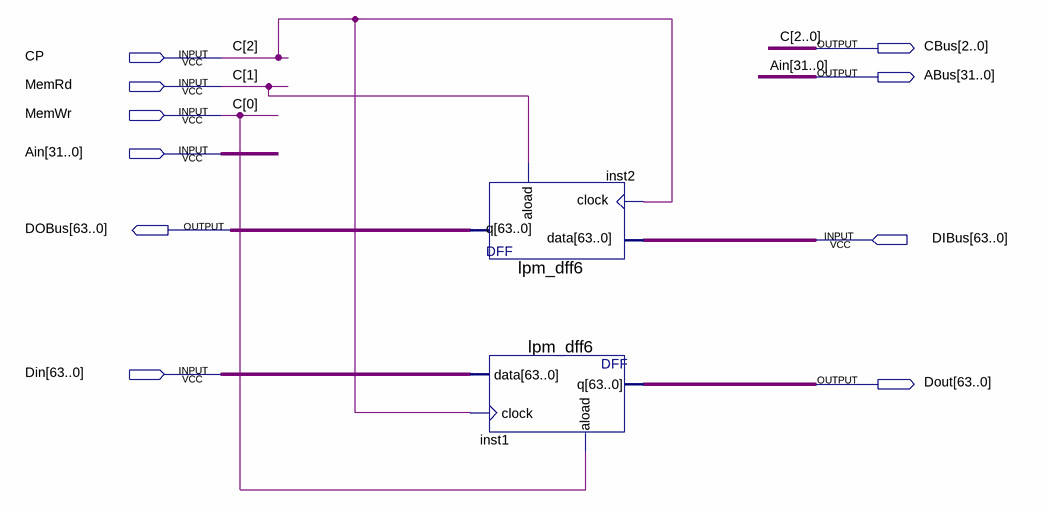
[diagram p0: schematic sheet]
// Quartus schematic DBIU.bdf as structural Verilog: 2 symbols, 10 pins
module DBIU (
  input  CP,
  input  MemRd,
  input  MemWr,
  input  [31:0] Ain,
  input  [63:0] DIBus,
  input  [63:0] Din,
  output [2:0] CBus,
  output [31:0] ABus,
  output [63:0] DOBus,
  output [63:0] Dout
);

  lpm_dff6 inst2 (.data(DIBus), .clock(CP), .aload(MemRd), .q(DOBus));
  lpm_dff6 inst1 (.data(Din), .clock(CP), .aload(MemWr), .q(Dout));

  assign ABus = Ain;
  assign CBus = {CP, MemRd, MemWr};

  // Other names for the same wires on the sheet: C[2:0] = {CP, MemRd, MemWr}
endmodule
